# Altium schematic sheet A4950.SchDoc
size A4
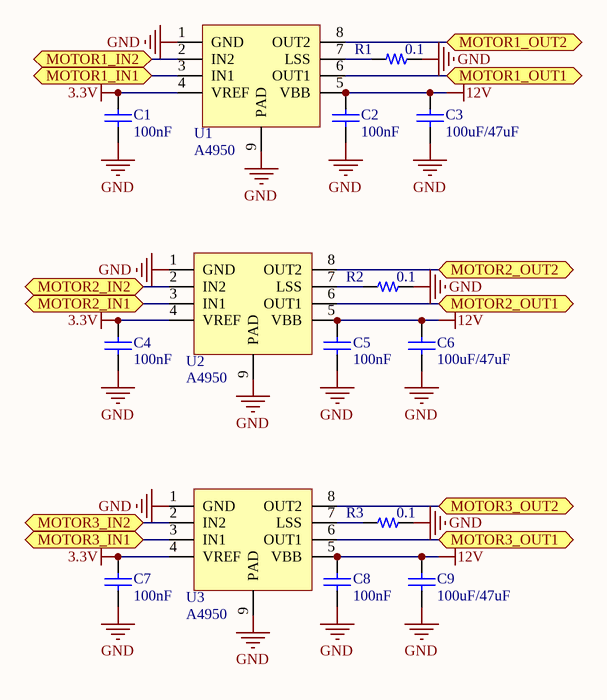
[diagram p0: A4950.SchDoc]

## Parts
C1  value 100nF  [dq - 0402]  (hidden comment: Cap)
C2  value 100nF  [dq - 0402]  (hidden comment: Cap)
C3  value 100uF/47uF  [dq - 1210]  (hidden comment: Cap)
C4  value 100nF  [dq - 0402]  (hidden comment: Cap)
C5  value 100nF  [dq - 0402]  (hidden comment: Cap)
C6  value 100uF/47uF  [dq - 1210]  (hidden comment: Cap)
C7  value 100nF  [dq - 0402]  (hidden comment: Cap)
C8  value 100nF  [dq - 0402]  (hidden comment: Cap)
C9  value 100uF/47uF  [dq - 1210]  (hidden comment: Cap)
R1  value 0.1  [DQ - 2512]  (hidden comment: Res)
R2  value 0.1  [DQ - 2512]  (hidden comment: Res)
R3  value 0.1  [DQ - 2512]  (hidden comment: Res)
U1  A4950  [LC-SOIC-8_150mil]
U2  A4950  [LC-SOIC-8_150mil]
U3  A4950  [LC-SOIC-8_150mil]

## Ports
MOTOR1_IN1, MOTOR1_IN2, MOTOR1_OUT1, MOTOR1_OUT2, MOTOR2_IN1, MOTOR2_IN2, MOTOR2_OUT1, MOTOR2_OUT2, MOTOR3_IN1, MOTOR3_IN2, MOTOR3_OUT1, MOTOR3_OUT2

## Nets
3.3V: C1.2 C4.2 C7.2 U1.4(VREF) U2.4(VREF) U3.4(VREF)
12V: C2.2 C3.2 C5.2 C6.2 C8.2 C9.2 U1.5(VBB) U2.5(VBB) U3.5(VBB)
GND: C1.1 C2.1 C3.1 C4.1 C5.1 C6.1 C7.1 C8.1 C9.1 R1.1 R2.1 R3.1 U1.1(GND) U1.9(PAD) U2.1(GND) U2.9(PAD) U3.1(GND) U3.9(PAD)
MOTOR1_IN1: U1.3(IN1) ; port MOTOR1_IN1
MOTOR1_IN2: U1.2(IN2) ; port MOTOR1_IN2
MOTOR1_OUT1: U1.6(OUT1) ; port MOTOR1_OUT1
MOTOR1_OUT2: U1.8(OUT2) ; port MOTOR1_OUT2
MOTOR2_IN1: U2.3(IN1) ; port MOTOR2_IN1
MOTOR2_IN2: U2.2(IN2) ; port MOTOR2_IN2
MOTOR2_OUT1: U2.6(OUT1) ; port MOTOR2_OUT1
MOTOR2_OUT2: U2.8(OUT2) ; port MOTOR2_OUT2
MOTOR3_IN1: U3.3(IN1) ; port MOTOR3_IN1
MOTOR3_IN2: U3.2(IN2) ; port MOTOR3_IN2
MOTOR3_OUT1: U3.6(OUT1) ; port MOTOR3_OUT1
MOTOR3_OUT2: U3.8(OUT2) ; port MOTOR3_OUT2
NetR1_2: R1.2 U1.7(LSS)
NetR2_2: R2.2 U2.7(LSS)
NetR3_2: R3.2 U3.7(LSS)

## Library data of the parts
C1-C9 = DQ_Cap: Capacitor; Published: 8-Jun-2000; LatestRevisionDate: 17-Jul-2002; LatestRevisionNote: Re-released for DXP Platform.; PackageReference: RAD-0.3; Publisher: Altium Limited
R1-R3 = DQ_Res: Resistance